# EasyEDA Pro project ProProject_RPi_Zero2W_Shield_2024-03-04.epro

# Schematic Schematic1
Create Date: 2024-02-14; Page Name: main; Project Name: RPi_Zero2W_Shield; Schematic Name: Schematic1; Update Date: 2024-02-16; Page Size: A4
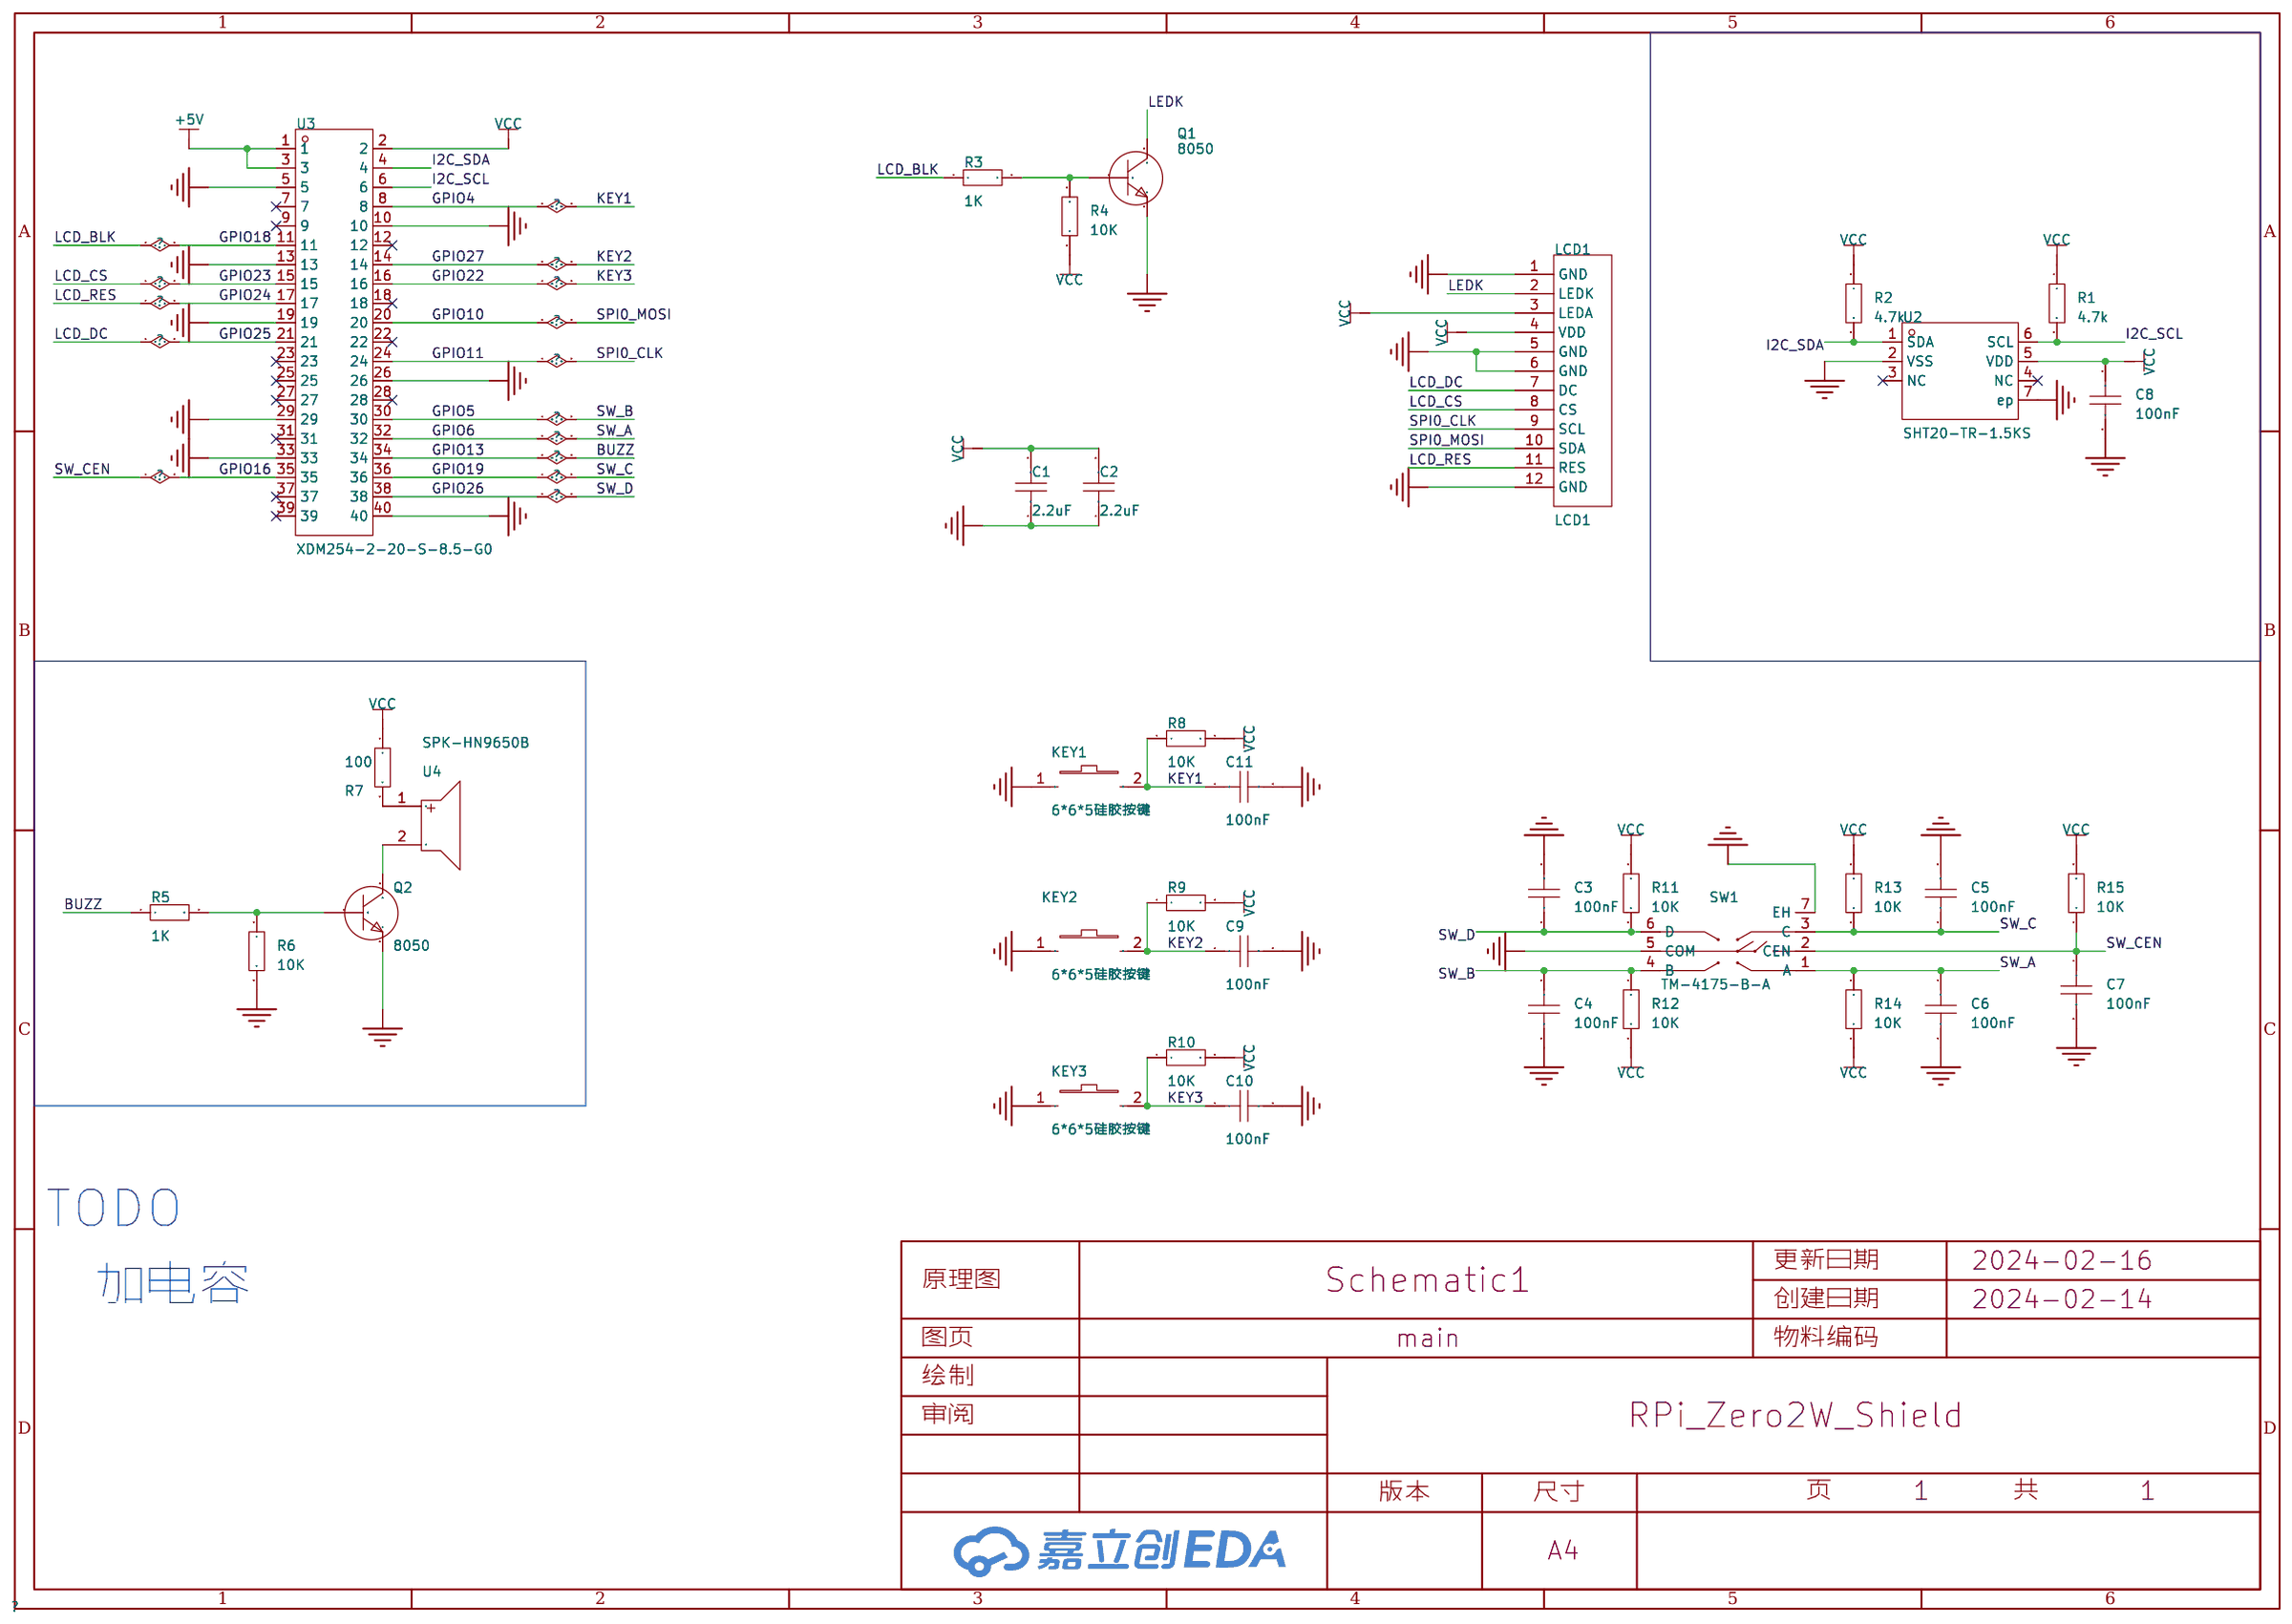
[diagram p0: schematic sheet]

## Parts
C1  2.2uF  [C0603]
C2  2.2uF  [C0603]
C3  100nF  [C0603]
C4  100nF  [C0603]
C5  100nF  [C0603]
C6  100nF  [C0603]
C7  100nF  [C0603]
C8  100nF  [C0603]
C9  100nF  [C0603]
C10  100nF  [C0603]
C11  100nF  [C0603]
KEY1  6*6*5硅胶按键  [KEY-SMD_L6.0-W6.0-LS6.6]
KEY2  6*6*5硅胶按键  [KEY-SMD_L6.0-W6.0-LS6.6]
KEY3  6*6*5硅胶按键  [KEY-SMD_L6.0-W6.0-LS6.6]
LCD1  LCD1  [LCD-1.69-12PIN]
Q1  8050  [SOT-23]
Q2  8050  [SOT-23]
R1  4.7k  [R0603]
R2  4.7k  [R0603]
R3  1K  [R0603]
R4  10K  [R0603]
R5  1K  [R0603]
R6  10K  [R0603]
R7  100  [R0603]
R8  10K  [R0603]
R9  10K  [R0603]
R10  10K  [R0603]
R11  10K  [R0603]
R12  10K  [R0603]
R13  10K  [R0603]
R14  10K  [R0603]
R15  10K  [R0603]
SW1  TM-4175-B-A  [SW-SMD_TM-4175-B-X]
U2  SHT20-TR-1.5KS  [DFN-6_L3.0-W3.0-P0.95-TR-EP]
U3  XDM254-2-20-S-8.5-G0  [HDR-SMD_40P-P2.54-V-F-R2-C20-S2.54-LS7.1]
U4  SPK-HN9650B  [BUZ-SMD_L9.6-W9.6-LS10.0-R]

## Library data of the parts
C1-C11 = CAP_0603: Supplier Footprint: 0603
KEY1-KEY3 = 轻触开关6*6*5硅胶无声按键: LCSC Part Name: 6*6*5  硅胶无声轻触按键; Supplier Part: C61120; Supplier Footprint: SMD; JLCPCB Part Class: 扩展库; Supplier: LCSC
LCD1 = LCD-1.69-12Pin: Supplier: LCSC; Supplier Part: C2932719; Manufacturer: kinghelm(金航标); Manufacturer Part: 1.69-LCD-12PIN; JLCPCB Part Class: 扩展库
Q1 Q2 = S8050: Supplier: LCSC; Manufacturer: CJ; image: //image.lceda.cn/szlcsc/C2146.jpg; Supplier Part: C2146; JLCPCB Part Class: 基础库
R1-R15 = Res_0603: Supplier Footprint: 0603
SW1 = TM-4175-B-A: 多功能开关 7.5*7.5*5 五向开关 H5; LCSC Part Name: 多功能开关 7.5*7.5*5 五向开关 H5; Supplier Part: C465995; Manufacturer: XKB Connectivity(中国星坤); Supplier Footprint: SMD-8P,7.5x7.5mm; JLCPCB Part Class: 扩展库; Datasheet: https://atta.szlcsc.com/upload/public/pdf/source/20211011/A0F6117F2AB0E02F6CF3847B7456F266.pdf; Supplier: LCSC
U2 = SHT20-TR-1.5KS: 1-100706-01, I2C接口，数字式温湿度传感器，电压范围: 2.1至3.6 V; Supplier Part: C53865; Manufacturer: Sensirion(瑞士盛思锐); Supplier Footprint: DFN-6-EP(3x3); JLCPCB Part Class: 扩展库; Datasheet: https://atta.szlcsc.com/upload/public/pdf/source/20151012/1457707445424.pdf; Supplier: LCSC
U3 = XDM254-2-20-S-8.5-G0: 插孔结构:2x20P;间距:2.54mm;圆孔/方孔:方孔;安装类型:立贴;排数:双排;总孔位数:40P;额定电流:3A;插孔方向:顶部;塑高:8.5mm;工作温度范围:-40℃~+105℃;; LCSC Part Name: 2x20P 间距:2.54mm 立贴; Supplier Part: C19268789; Manufacturer: XUNDA(讯答); Supplier Footprint: SMD,P=2.54mm; JLCPCB Part Class: 扩展库; Datasheet: https://atta.szlcsc.com/upload/public/pdf/source/20231121/6EC010327DDA6B0DB4C4459097C10220.pdf; Supplier: LCSC; Holes Structure: 2x20P; Pitch: 2.54mm; Circular Hole / Square Hole: 方孔; Mounting Type: 立贴; Number of Rows: 双排; Number of Holes: 40P; Current Rating (Max): 3A; Holes Direction: 顶部; Insulation Height: 8.5mm; Operating Temperature Range: -40℃~+105℃
U4 = SPK-HN9650B: Supplier Part: C9900001784; Supplier Footprint: BUZ-SMD_L9.6-W9.6; JLCPCB Part Class: 扩展库; Supplier: LCSC

## Nets
+5V: U3.1 U3.3
GND: C1.1 C2.1 C3.2 C4.2 C5.2 C6.2 C7.2 C8.2 C9.2 C10.2 C11.2 KEY1.1 KEY2.1 KEY3.1 LCD1.1(GND) LCD1.5(GND) LCD1.6(GND) LCD1.12(GND) Q1.2(E) Q2.2(E) R6.2 SW1.5(COM) SW1.7(EH) U2.2(VSS) U2.7(ep) U3.5 U3.10 U3.13 U3.19 U3.26 U3.29 U3.33 U3.40
VCC: C1.2 C2.2 C8.1 LCD1.3(LEDA) LCD1.4(VDD) R1.1 R2.1 R4.1 R7.1 R8.2 R9.2 R10.2 R11.1 R12.2 R13.1 R14.2 R15.2 U2.5(VDD) U3.2
BUZZ: R5.1 U3.34
GPIO4: C11.1 KEY1.2 R8.1 U3.8
GPIO5: C4.1 R12.1 SW1.4(B) U3.30
GPIO6: C6.1 R14.1 SW1.1(A) U3.32
GPIO10: LCD1.10(SDA) U3.20
GPIO11: LCD1.9(SCL) U3.24
GPIO16: C7.1 R15.1 SW1.2(CEN) U3.35
GPIO18: R3.1 U3.11
GPIO19: C5.1 R13.2 SW1.3(C) U3.36
GPIO22: C10.1 KEY3.2 R10.1 U3.16
GPIO23: LCD1.8(CS) U3.15
GPIO24: LCD1.11(RES) U3.17
GPIO25: LCD1.7(DC) U3.21
GPIO26: C3.1 R11.2 SW1.6(D) U3.38
GPIO27: C9.1 KEY2.2 R9.1 U3.14
I2C_SCL: R1.2 U2.6(SCL) U3.6
I2C_SDA: R2.2 U2.1(SDA) U3.4
LEDK: LCD1.2(LEDK) Q1.3(C)
$1N2929: Q1.1(B) R3.2 R4.2
$1N5178: Q2.3(C) U4.2
$1N5180: Q2.1(B) R5.2 R6.1
$1N5288: R7.2 U4.1

Not connected (* = marked no-connect by the designer): U2 3(NC)* 4(NC)*; U3 7* 9* 12* 18* 22* 23* 25* 27* 28* 31* 37* 39*

## Notes on the sheet
- TODO
- 加电容

# Board PCB1
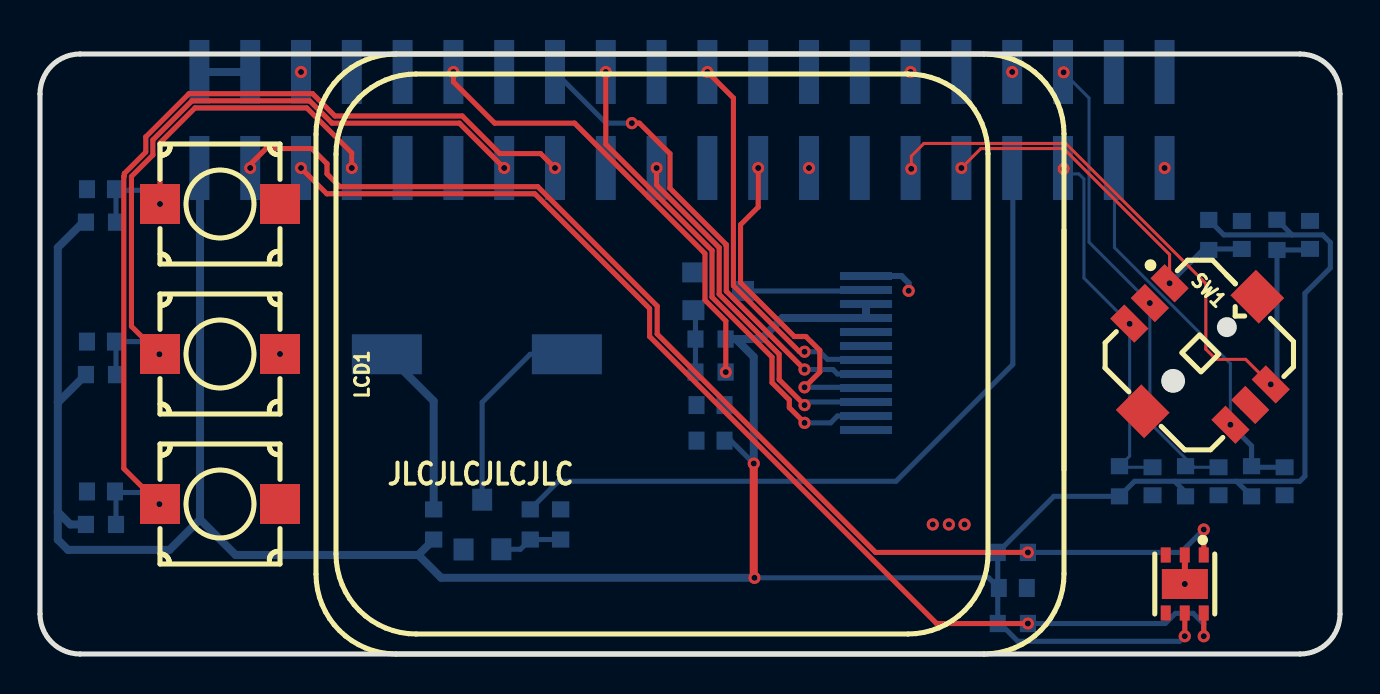
[diagram p1: board, top side]
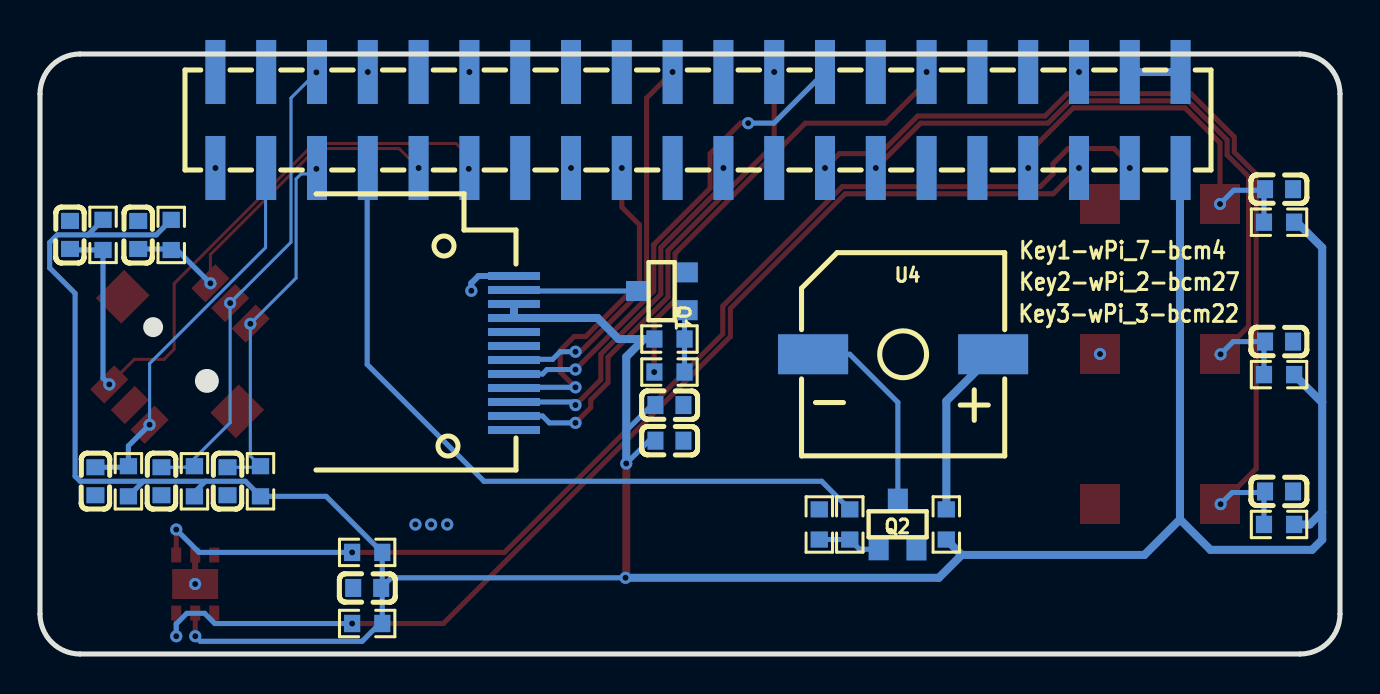
[diagram p2: board, bottom side, seen from below]

Outline 65 x 30 mm; copper layers: Top Layer, Bottom Layer. Coordinates in mm from the lower left corner of the outline.
Outline path: 0,28 0,2 arc(0.59,0.59) 2,0 63,0 arc(64.41,0.59) 65,2 65,28 arc(64.41,29.41) 63,30 2,30 arc(0.59,29.41) 0,28
Stack: Top Layer 0.035mm / Dielectric1 1.51mm FR4 er 4.5 / Bottom Layer 0.035mm

## Design rules (mm)
template: JLCPCB Capability(Two Layers Board)
spacing copperThickness1oz (default): track to track 0.102, other pairs 0.152 to 0.3
spacing copperThickness2oz: track to track 0.203, other pairs 0.152 to 0.3
track width copperThickness1oz (default): min 0.127, default 0.254, max 2.54
track width copperThickness2oz: min 0.203, default 0.254, max 2.54
differential pair differentialPair (default): width min 0.127, default 0.254, max 2.54; gap min 0.152, default 0.152
via viaSize (default): diameter min 0.5, default 0.61, max 10; hole min 0.3, default 0.305, max 6.3

## Placement (name value [footprint] x y rotation side)
C1  2.2uF  [C0603]  33.53 10.67 0 bottom
C2  2.2uF  [C0603]  33.53 12.45 0 bottom
C3  100nF  [C0603]  62.23 8.64 270 bottom
C4  100nF  [C0603]  63.5 20.95 90 bottom
C5  100nF  [C0603]  55.63 8.64 270 bottom
C6  100nF  [C0603]  60.09 20.95 90 bottom
C7  100nF  [C0603]  58.93 8.64 270 bottom
C8  100nF  [C0603]  48.64 3.3 0 bottom
C9  100nF  [C0603]  3.05 15.62 180 bottom
C10  100nF  [C0603]  3.05 8.13 180 bottom
C11  100nF  [C0603]  3.05 23.24 180 bottom
KEY1  6*6*5硅胶按键  [KEY-SMD_L6.0-W6.0-LS6.6]  9 22.5 180 top
KEY2  6*6*5硅胶按键  [KEY-SMD_L6.0-W6.0-LS6.6]  9 15 180 top
KEY3  6*6*5硅胶按键  [KEY-SMD_L6.0-W6.0-LS6.6]  9 7.5 180 top
LCD1  LCD1  [LCD-1.69-12PIN]  32.5 15 90 top
Q1  8050  [SOT-23]  33.91 18.16 90 bottom
Q2  8050  [SOT-23]  22.1 6.48 180 bottom
R1  4.7k  [R0603]  48.64 1.52 0 bottom
R2  4.7k  [R0603]  48.64 5.08 0 bottom
R3  1K  [R0603]  33.53 14.1 180 bottom
R4  10K  [R0603]  33.53 15.75 180 bottom
R5  1K  [R0603]  24.51 6.48 270 bottom
R6  10K  [R0603]  26.03 6.48 90 bottom
R7  100  [R0603]  19.69 6.48 90 bottom
R8  10K  [R0603]  3.05 21.59 180 bottom
R9  10K  [R0603]  3.05 13.97 180 bottom
R10  10K  [R0603]  3.05 6.48 180 bottom
R11  10K  [R0603]  60.58 8.64 90 bottom
R12  10K  [R0603]  61.85 20.95 90 bottom
R13  10K  [R0603]  53.97 8.64 90 bottom
R14  10K  [R0603]  58.44 20.95 90 bottom
R15  10K  [R0603]  57.28 8.64 270 bottom
SW1  TM-4175-B-A  [SW-SMD_TM-4175-B-X]  58 15 315 top
U2  SHT20-TR-1.5KS  [DFN-6_L3.0-W3.0-P0.95-TR-EP]  57.24 3.5 0 top
U3  XDM254-2-20-S-8.5-G0  [HDR-SMD_40P-P2.54-V-F-R2-C20-S2.54-LS7.1]  32.1 26.7 0 bottom
U4  SPK-HN9650B  [BUZ-SMD_L9.6-W9.6-LS10.0-R]  21.84 14.99 180 bottom

## Footprints (pads in the part's own frame, mm; a bottom-side part is the same pattern mirrored in y, then rotated)
BUZ-SMD_L9.6-W9.6-LS10.0-R
  rect 3.5x2 smd: 1(4.5,0) 2(-4.5,0)
C0603
  rect 0.8x0.9 smd: 1(-0.7,0) 2(0.7,0)
DFN-6_L3.0-W3.0-P0.95-TR-EP
  rect 0.5x0.75 smd: 1(0.95,1.452) 2(0,1.451) 3(-0.95,1.45) 4(-0.95,-1.452) 5(0,-1.452) 6(0.95,-1.451)
  rect 2.3x1.5 smd: 7(0.004,-0.001)
HDR-SMD_40P-P2.54-V-F-R2-C20-S2.54-LS7.1
  rect 1x3.2 smd: 1(-24.13,-2.4) 2(-24.13,2.4) 3(-21.59,-2.4) 4(-21.59,2.4) 5(-19.05,-2.4) 6(-19.05,2.4) 7(-16.51,-2.4) 8(-16.51,2.4) 9(-13.97,-2.4) 10(-13.97,2.4) 11(-11.43,-2.4) 12(-11.43,2.4) 13(-8.89,-2.4) 14(-8.89,2.4) 15(-6.35,-2.4) 16(-6.35,2.4) 17(-3.81,-2.4) 18(-3.81,2.4) 19(-1.27,-2.4) 20(-1.27,2.4) 21(1.27,-2.4) 22(1.27,2.4) 23(3.81,-2.4) 24(3.81,2.4) 25(6.35,-2.4) 26(6.35,2.4) 27(8.89,-2.4) 28(8.89,2.4) 29(11.43,-2.4) 30(11.43,2.4) 31(13.97,-2.4) 32(13.97,2.4) 33(16.51,-2.4) 34(16.51,2.4) 35(19.05,-2.4) 36(19.05,2.4) 37(21.59,-2.4) 38(21.59,2.4) 39(24.13,-2.4) 40(24.13,2.4)
KEY-SMD_L6.0-W6.0-LS6.6
  rect 2x2 smd: 1(-3,0) 2(3,0)
LCD-1.69-12PIN
  rect 0.4x2.6 smd far side: 1(3.9,-8.8) 2(3.2,-8.8) 3(2.5,-8.8) 4(1.8,-8.8) 5(1.1,-8.8) 6(0.4,-8.8) 7(-0.3,-8.8) 8(-1,-8.8) 9(-1.7,-8.8) 10(-2.4,-8.8) 11(-3.1,-8.8) 12(-3.8,-8.8)
R0603
  rect 0.806x0.864 smd: 1(-0.753,0) 2(0.753,0)
SOT-23
  rect 1x1.1 smd: 1(-0.97,-1.24) 2(0.92,-1.25) 3(-0.01,1.24)
SW-SMD_TM-4175-B-X
  rect 1.7x1 smd: 1(-3.575,1.425) 2(-3.575,0.028) 3(-3.575,-1.425) 4(3.575,1.425) 5(3.575,-0.028) 6(3.575,-1.425)
  rect 2x1.8 smd: 7(0,4.05) 7(0,-4.05)

## Nets
As in the schematic.

Pads without a net: U2 3 4; U3 7 9 12 18 22 23 25 27 28 31 37 39

## Via types
v1: diameter 0.61, hole 0.305, Top Layer to Bottom Layer, 47 vias

## Routing (per net, layer and track width the routed paths; a pad name or vN(x,y) marks a point on that pad's centre or on a via; arc(x,y) is an arc through that point)
+5V: length 2.5
  Bottom Layer w0.4: U3.1 U3.3
GND: length 4.1
  Top Layer w0.3: U2.2 57.24,4.95 v1(57.24,3.5)
  Bottom Layer w0.3: v1(43.43,18.16) 43.43,18.54 43.08,18.9 LCD1.1
  vias: v1(12,15) v1(13.05,29.1) v1(38.45,24.3) v1(43.53,29.1) v1(44.64,6.48) v1(45.45,6.48) v1(46.23,6.48) v1(48.61,29.1) v1(56.23,24.3)
VCC: length 165.8
  Top Layer w0.254: U2.5 v1(57.24,0.89)
  Top Layer w0.4: v1(35.69,9.53) 35.69,3.85 v1(35.72,3.81)
  Bottom Layer w0.254: R14.2 59.19,20.95 62.6,20.95 ; 35.69,11.16 34.4,12.45 C2.2 ; 62.6,20.95 64.13,20.95 64.52,20.57 64.52,19.3 63.25,18.03 63.25,8.89 62.99,8.64 59.83,8.64 ; 62.6,20.95 R12.2 ; R15.2 57.28,8.09 56.73,8.64 ; 59.83,8.64 R11.1 ; 59.83,8.64 56.73,8.64 ; C1.2 34.54,10.67 v1(35.69,9.53) ; 56.73,8.64 54.73,8.64 R13.1 50.69,7.88 R2.1 47.89,3.36 ; 47.89,3.36 47.43,3.81 v1(35.72,3.81) ; 47.89,3.36 47.89,1.64 48.9,0.64 56.98,0.64 v1(57.24,0.89) ; 47.89,3.36 C8.1
  Bottom Layer w0.4: v1(35.72,3.81) 20.06,3.81 18.91,4.95 ; U3.2 8,24.27 8,6.73 ; 0.89,12.59 0.91,12.59 R9.2 ; 0.89,12.59 0.89,20.32 2.16,21.59 R8.2 ; 0.89,12.59 0.89,7.1 ; LCD1.3 LCD1.4 37.12,16.8 36.07,15.75 34.8,15.75 ; 34.8,15.75 35.69,14.86 v1(35.69,9.53) ; 34.8,15.75 R4.1 ; R10.2 1.51,6.48 0.89,7.1 ; 18.91,4.95 R7.1 ; 18.91,4.95 9.78,4.95 8,6.73 ; 0.89,7.1 0.89,5.72 1.4,5.21 6.48,5.21 8,6.73
BUZZ: length 37
  Bottom Layer w0.254: R5.1 25.92,8.64 42.8,8.64 48.64,14.48 48.64,24.27 U3.34
GPIO4: length 19.2
  Top Layer w0.254: v1(6,22.5) 6,25.56 7.75,27.31 13.34,27.31 15.59,25.05 v1(15.59,24.3)
  Bottom Layer w0.254: 3.8,23.19 5.31,23.19 v1(6,22.5) ; 3.8,23.19 R8.1 ; 3.8,23.19 C11.1
GPIO5: length 34.3
  Top Layer w0.152: v1(43.56,24.26) 43.56,24.89 44.2,25.53 51.29,25.53 58.29,18.52 58.29,15.24 58.8,14.73 60.28,14.73 v1(61.54,13.48)
  Bottom Layer w0.254: C4.1 63.45,20.2 R12.1 61.85,13.79 v1(61.54,13.48)
GPIO6: length 18.8
  Top Layer w0.152: v1(46.07,24.3) 47.04,25.27 51.18,25.27 56.48,19.97 v1(56.48,18.54)
  Bottom Layer w0.254: v1(56.48,18.54) 58.2,20.25 C6.1
GPIO10: length 18.1
  Top Layer w0.254: v1(38.23,12.45) 36.96,13.72 36.96,14.99 33.96,17.99 33.96,20.32 30.83,23.45 v1(30.83,24.3)
  Bottom Layer w0.254: LCD1.10 38.38,12.6 v1(38.23,12.45)
GPIO11: length 16.7
  Top Layer w0.254: v1(35.91,24.3) 35.91,22.35 35.03,21.46 35.03,18.56 37.71,15.88 38.29,15.88 38.99,15.18 38.99,14.1 v1(38.23,13.33)
  Bottom Layer w0.254: LCD1.9 41.26,13.33 v1(38.23,13.33)
GPIO16: length 23.7
  Bottom Layer w0.152: C7.1 57.72,9.34 55.49,11.56 v1(55.49,17.55) 52.45,20.59 52.45,27.8 U3.35
  vias: v1(51.18,29.08)
GPIO18: length 23
  Top Layer w0.254: v1(34.29,14.1) 34.29,16.65 33.25,17.69 33.25,20.03 26.73,26.54 22.73,26.54 20.67,28.61 v1(20.67,29.1)
GPIO19: length 18.5
  Bottom Layer w0.152: U3.36 51.45,24 51.94,24 52.2,23.75 52.2,18.8 v1(54.48,16.51) 54.48,9.9 R13.2 54.03,9.34 C5.1
  vias: v1(51.18,24.26)
GPIO22: length 46.5
  Top Layer w0.254: v1(25.75,24.3) 25.03,25.02 22.99,25.02 21.11,26.9 14.75,26.9 13.63,28.02 7.45,28.02 5.29,25.85 5.29,25.1 4.22,24.02 4.22,23.9 4.19,23.88 4.19,9.27 v1(5.97,7.49)
  Bottom Layer w0.254: 3.8,8.07 5.39,8.07 v1(5.97,7.49) ; 3.8,8.07 C10.1 ; 3.8,8.07 R10.1
GPIO23: length 24.2
  Top Layer w0.254: v1(38.23,14.22) 34.31,18.14 34.31,20.42 34.29,20.44 34.31,20.47 31.5,23.29 31.5,25.02 29.97,26.54 v1(29.59,26.54)
  Bottom Layer w0.254: U3.15 28.31,26.54 v1(29.59,26.54) ; v1(38.23,14.22) 39.65,14.22 39.87,14 LCD1.8
GPIO24: length 24.9
  Top Layer w0.254: v1(38.23,11.56) 37.47,12.32 37.47,12.7 36.6,13.57 36.6,14.84 33.6,17.84 33.6,20.17 28.29,25.49 v1(28.29,29.1)
  Bottom Layer w0.254: v1(38.23,11.56) 39.53,11.56 39.87,11.9 LCD1.11
GPIO25: length 19.4
  Top Layer w0.254: v1(33.37,29.1) 34.67,27.8 34.67,18.42 37.97,15.11 v1(38.23,15.11)
  Bottom Layer w0.254: v1(38.23,15.11) 38.99,15.11 39.37,14.73 41.27,14.73 LCD1.7
GPIO26: length 19.4
  Bottom Layer w0.152: v1(59.52,11.46) 59.52,14.52 53.72,20.32 53.72,24.27 U3.38
  Bottom Layer w0.254: v1(59.52,11.46) 60.58,10.41 R11.2 60.63,9.34 C3.1
GPIO27: length 35.7
  Top Layer w0.254: v1(23.21,24.3) 20.97,26.54 14.6,26.54 13.48,27.66 7.6,27.66 5.64,25.71 5.64,24.95 4.57,23.88 4.57,16.38 v1(5.97,14.99)
  Bottom Layer w0.254: v1(5.97,14.99) 5.33,15.62 C9.1 3.8,15.57 R9.1
I2C_SCL: length 57.6
  Top Layer w0.254: v1(13.05,24.3) 14.34,23.01 24.74,23.01 30.48,17.27 30.48,15.88 44.83,1.52 44.84,1.52 v1(49.39,1.52) ; U2.6 v1(58.19,0.89)
  Bottom Layer w0.254: v1(58.19,0.89) 58.19,1.5 57.66,2.03 56.77,2.03 56.26,1.52 v1(49.39,1.52)
I2C_SDA: length 59.4
  Top Layer w0.254: U2.1 v1(58.19,6.22) ; v1(49.39,5.08) 41.78,5.08 30.86,16 30.86,17.39 24.89,23.37 14.99,23.37 14.35,24 14.35,24.51 13.59,25.27 11.3,25.27 10.51,24.48 v1(10.51,24.3)
  Bottom Layer w0.254: v1(49.39,5.08) 57.04,5.08 v1(58.19,6.22)
LEDK: length 6.2
  Bottom Layer w0.254: Q1.3 41.25,18.15 LCD1.2
$1N2929: length 3.1
  Bottom Layer w0.254: R3.2 R4.2 32.77,17.09 Q1.1
$1N5178: length 10.1
  Bottom Layer w0.254: Q2.3 22.11,12.58 24.51,14.99 U4.2
$1N5180: length 3.2
  Bottom Layer w0.254: 23.07,5.24 24.02,5.24 R5.2 R6.1
$1N5288: length 8.7
  Bottom Layer w0.4: R7.2 19.69,12.64 U4.1

## Copper pours and planes (outline as drawn; the poured copper is in the pictures)
GND on Top Layer: -4.57,35.56 73.03,35.56 73.03,-4.57 -4.57,-4.57
GND on Bottom Layer: -8.51,36.19 72.77,36.19 72.77,-7.62 -8.51,-7.62

## Text on the board
Bottom Silkscreen Layer: Key1-wPi_7-bcm4 | Key2-wPi_2-bcm27 | Key3-wPi_3-bcm22
Top Solder Mask Layer: Design | By | AQin
Top Silkscreen Layer: JLCJLCJLCJLC
